# Altium project Pod3.PrjPcb
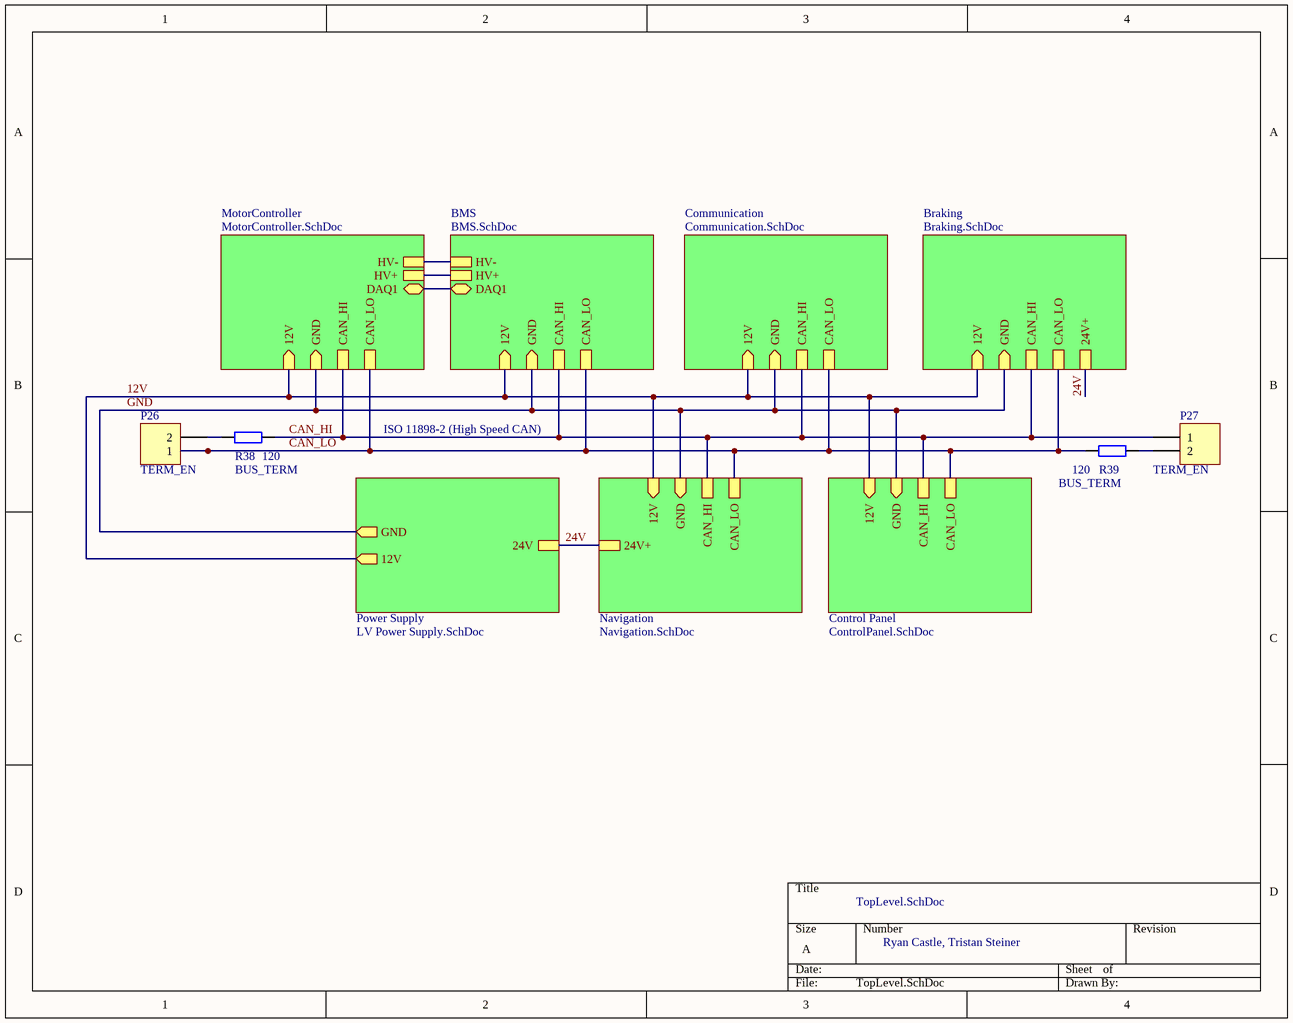
[diagram p0: TopLevel.SchDoc]
6 sheets, 148 parts. Net scope: hierarchical (ports join the sheet entries above them; power ports are global).
Board files: Navigation.PcbDoc, Braking.PcbDoc, Propulsion.PcbDoc, Communication.PcbDoc, ControlPanel.PcbDoc, Shutdown.PcbDoc
Sheets:
  TopLevel.SchDoc
    BMS = BMS.SchDoc
      BMS Main I/O Connector = BMSIOConnector.SchDoc
    Braking = Braking.SchDoc
    Navigation = Navigation.SchDoc
    Power Supply = LV Power Supply.SchDoc

## Sheet TopLevel.SchDoc
size A; SheetNumber: 1

### Parts
P26  TERM_EN  [HDR1X2]
P27  TERM_EN  [HDR1X2]
R38  BUS_TERM  value 120  [AXIAL-0.4]
R39  BUS_TERM  value 120  [AXIAL-0.4]

### Sub-sheets
BMS = BMS.SchDoc: CAN_HI, CAN_LO, 12V (in), GND (in), HV-, HV+, DAQ1 (bidir)
Braking = Braking.SchDoc: CAN_HI, CAN_LO, 12V (in), GND (in), 24V+
Communication = Communication.SchDoc (file not in this document): CAN_HI, CAN_LO, 12V (in), GND (in)
Control Panel = ControlPanel.SchDoc (file not in this document): CAN_HI, CAN_LO, 12V (in), GND (in)
MotorController = MotorController.SchDoc (file not in this document): CAN_HI, CAN_LO, 12V (in), GND (in), HV+, HV-, DAQ1 (bidir)
Navigation = Navigation.SchDoc: CAN_HI, CAN_LO, 12V (in), GND (in), 24V+
Power Supply = LV Power Supply.SchDoc: 12V (out), GND (out), 24V

### Nets
GND: sheet BMS/GND, sheet Communication/GND, sheet Braking/GND, sheet Navigation/GND, sheet Control Panel/GND, sheet MotorController/GND, sheet Power Supply/GND  [project net 12VBat-]
12V: sheet BMS/12V, sheet Communication/12V, sheet Braking/12V, sheet Navigation/12V, sheet Control Panel/12V, sheet MotorController/12V, sheet Power Supply/12V
24V: sheet Braking/24V+, sheet Navigation/24V+, sheet Power Supply/24V
CAN_HI: P27.1 R38.2 ; sheet BMS/CAN_HI, sheet Communication/CAN_HI, sheet Braking/CAN_HI, sheet Navigation/CAN_HI, sheet Control Panel/CAN_HI, sheet MotorController/CAN_HI
CAN_LO: P26.1 R39.1 ; sheet BMS/CAN_LO, sheet Communication/CAN_LO, sheet Braking/CAN_LO, sheet Navigation/CAN_LO, sheet Control Panel/CAN_LO, sheet MotorController/CAN_LO
HV+: sheet BMS/HV+, sheet MotorController/HV+
HV-: sheet BMS/HV-, sheet MotorController/HV-
NetP26_2: P26.2 R38.1
NetP27_2: P27.2 R39.2
(unnamed): sheet BMS/DAQ1, sheet MotorController/DAQ1

### Notes on the sheet
- ISO 11898-2 (High Speed CAN)
- TopLevel.SchDoc
- Ryan Castle, Tristan Steiner

### Library data of the parts
P26 P27 = Header 2: Header, 2-Pin; LatestRevisionDate: 17-Jul-2002; LatestRevisionNote: Re-released for DXP Platform.; Publisher: Altium Limited
R38 R39 = Res2: Resistor; Published: 8-Jun-2000; LatestRevisionDate: 17-Jul-2002; LatestRevisionNote: Re-released for DXP Platform.; PackageReference: AXIAL-0.4; Publisher: Altium Limited; PackageDescription: Axial Device, Thru-Hole; 2 Leads; 0.4 in Pin Spacing

## Sheet BMS.SchDoc: =Battery System
size B; SheetNumber: 2
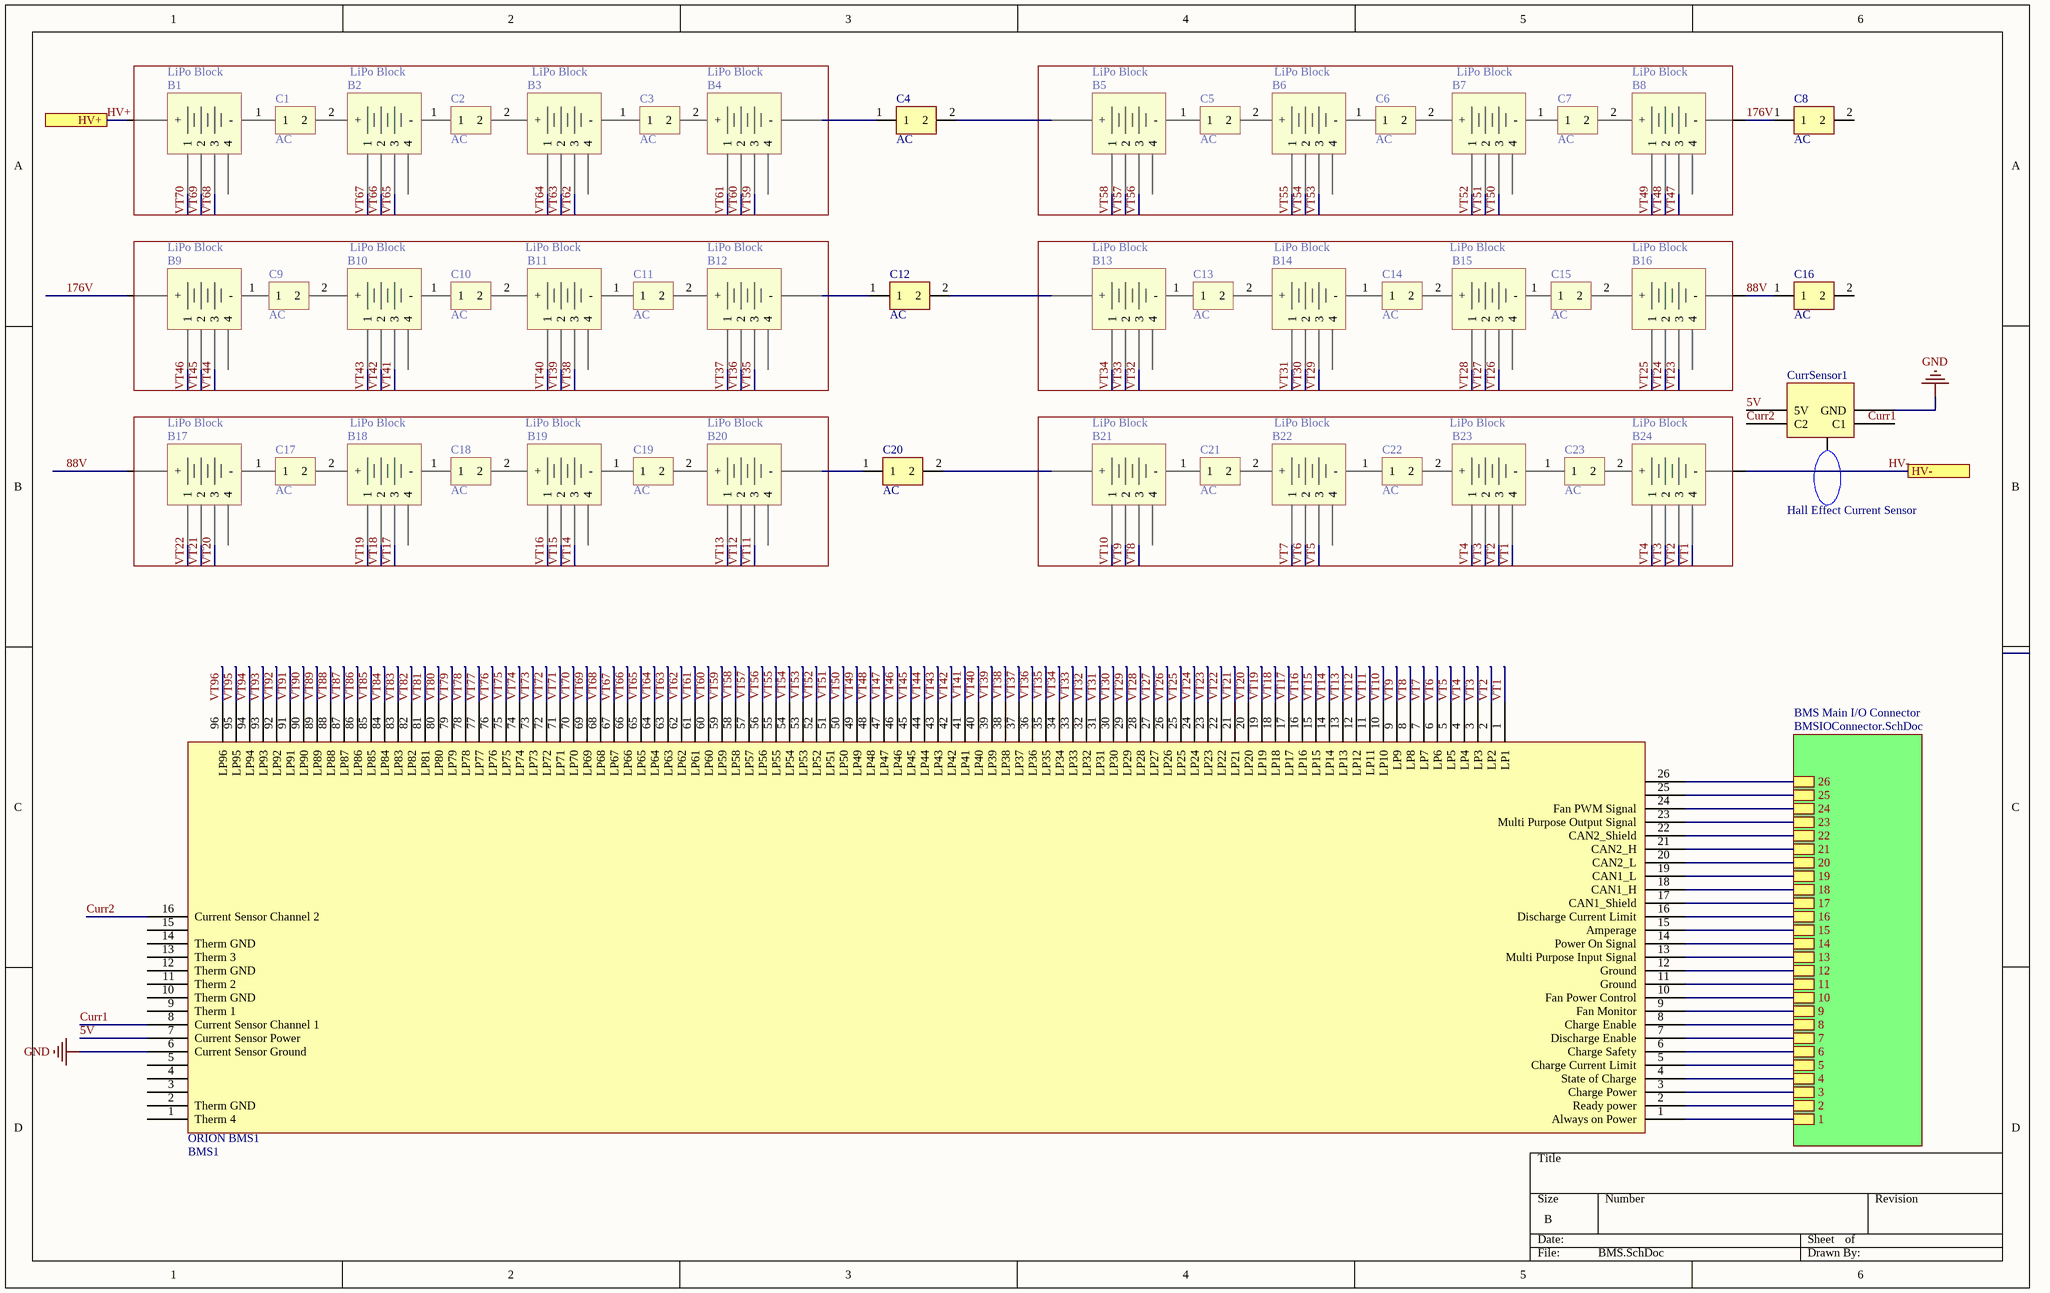
[diagram p1: BMS.SchDoc]

### Parts
B1  LiPo Block
B2  LiPo Block
B3  LiPo Block
B4  LiPo Block
B5  LiPo Block
B6  LiPo Block
B7  LiPo Block
B8  LiPo Block
B9  LiPo Block
B10  LiPo Block
B11  LiPo Block
B12  LiPo Block
B13  LiPo Block
B14  LiPo Block
B15  LiPo Block
B16  LiPo Block
B17  LiPo Block
B18  LiPo Block
B19  LiPo Block
B20  LiPo Block
B21  LiPo Block
B22  LiPo Block
B23  LiPo Block
B24  LiPo Block
C1  AC
C2  AC
C3  AC
C4  AC
C5  AC
C6  AC
C7  AC
C8  AC
C9  AC
C10  AC
C11  AC
C12  AC
C13  AC
C14  AC
C15  AC
C16  AC
C17  AC
C18  AC
C19  AC
C20  AC
C21  AC
C22  AC
C23  AC
CurrSensor1  Hall Effect Current Sensor
ORION_BMS1  BMS1

### Sub-sheets
BMS Main I/O Connector = BMSIOConnector.SchDoc: 26, 25, 24, 23, 22, 21, 20, 19, 18, 17, 16, 15, 14, 13, 12, 11, 10, 9, 8, 7, 6, 5, 4, 3, 2, 1

### Ports
HV+, HV-

### Nets
GND: CurrSensor1.2(GND) ORION_BMS1.6(Current_Sensor_Ground)  [project net 12VBat-]
5V: CurrSensor1.3(5V) ORION_BMS1.7(Current_Sensor_Power)
88V: B16.6(-) B17.5(+) C16.1
176V: B8.6(-) B9.5(+) C8.1
Curr1: ORION_BMS1.8(Current_Sensor_Channel_1)
Curr2: CurrSensor1.4(C2) ORION_BMS1.16(Current_Sensor_Channel_2)
HV+: B1.5(+) ; port HV+
HV-: B24.6(-) ; port HV-
VT1: B23.4 B24.4 ORION_BMS1.1(LP1)
VT2: B23.3 B24.3 ORION_BMS1.2(LP2)
VT3: B23.2 B24.2 ORION_BMS1.3(LP3)
VT4: B23.1 B24.1 ORION_BMS1.4(LP4)
VT5: B22.3 ORION_BMS1.5(LP5)
VT6: B22.2 ORION_BMS1.6(LP6)
VT7: B22.1 ORION_BMS1.7(LP7)
VT8: B21.3 ORION_BMS1.8(LP8)
VT9: B21.2 ORION_BMS1.9(LP9)
VT10: B21.1 ORION_BMS1.10(LP10)
VT11: B20.3 ORION_BMS1.11(LP11)
VT12: B20.2 ORION_BMS1.12(LP12)
VT13: B20.1 ORION_BMS1.13(LP13)
VT14: B19.3 ORION_BMS1.14(LP14)
VT15: B19.2 ORION_BMS1.15(LP15)
VT16: B19.1 ORION_BMS1.16(LP16)
VT17: B18.3 ORION_BMS1.17(LP17)
VT18: B18.2 ORION_BMS1.18(LP18)
VT19: B18.1 ORION_BMS1.19(LP19)
VT20: B17.3 ORION_BMS1.20(LP20)
VT21: B17.2 ORION_BMS1.21(LP21)
VT22: B17.1 ORION_BMS1.22(LP22)
VT23: B16.3 ORION_BMS1.23(LP23)
VT24: B16.2 ORION_BMS1.24(LP24)
VT25: B16.1 ORION_BMS1.25(LP25)
VT26: B15.3 ORION_BMS1.26(LP26)
VT27: B15.2 ORION_BMS1.27(LP27)
VT28: B15.1 ORION_BMS1.28(LP28)
VT29: B14.3 ORION_BMS1.29(LP29)
VT30: B14.2 ORION_BMS1.30(LP30)
VT31: B14.1 ORION_BMS1.31(LP31)
VT32: B13.3 ORION_BMS1.32(LP32)
VT33: B13.2 ORION_BMS1.33(LP33)
VT34: B13.1 ORION_BMS1.34(LP34)
VT35: B12.3 ORION_BMS1.35(LP35)
VT36: B12.2 ORION_BMS1.36(LP36)
VT37: B12.1 ORION_BMS1.37(LP37)
VT38: B11.3 ORION_BMS1.38(LP38)
VT39: B11.2 ORION_BMS1.39(LP39)
VT40: B11.1 ORION_BMS1.40(LP40)
VT41: B10.3 ORION_BMS1.41(LP41)
VT42: B10.2 ORION_BMS1.42(LP42)
VT43: B10.1 ORION_BMS1.43(LP43)
VT44: B9.3 ORION_BMS1.44(LP44)
VT45: B9.2 ORION_BMS1.45(LP45)
VT46: B9.1 ORION_BMS1.46(LP46)
VT47: B8.3 ORION_BMS1.47(LP47)
VT48: B8.2 ORION_BMS1.48(LP48)
VT49: B8.1 ORION_BMS1.49(LP49)
VT50: B7.3 ORION_BMS1.50(LP50)
VT51: B7.2 ORION_BMS1.51(LP51)
VT52: B7.1 ORION_BMS1.52(LP52)
VT53: B6.3 ORION_BMS1.53(LP53)
VT54: B6.2 ORION_BMS1.54(LP54)
VT55: B6.1 ORION_BMS1.55(LP55)
VT56: B5.3 ORION_BMS1.56(LP56)
VT57: B5.2 ORION_BMS1.57(LP57)
VT58: B5.1 ORION_BMS1.58(LP58)
VT59: B4.3 ORION_BMS1.59(LP59)
VT60: B4.2 ORION_BMS1.60(LP60)
VT61: B4.1 ORION_BMS1.61(LP61)
VT62: B3.3 ORION_BMS1.62(LP62)
VT63: B3.2 ORION_BMS1.63(LP63)
VT64: B3.1 ORION_BMS1.64(LP64)
VT65: B2.3 ORION_BMS1.65(LP65)
VT66: B2.2 ORION_BMS1.66(LP66)
VT67: B2.1 ORION_BMS1.67(LP67)
VT68: B1.3 ORION_BMS1.68(LP68)
VT69: B1.2 ORION_BMS1.69(LP69)
VT70: B1.1 ORION_BMS1.70(LP70)
VT71: ORION_BMS1.71(LP71)
VT72: ORION_BMS1.72(LP72)
VT73: ORION_BMS1.73(LP73)
VT74: ORION_BMS1.74(LP74)
VT75: ORION_BMS1.75(LP75)
VT76: ORION_BMS1.76(LP76)
VT77: ORION_BMS1.77(LP77)
VT78: ORION_BMS1.78(LP78)
VT79: ORION_BMS1.79(LP79)
VT80: ORION_BMS1.80(LP80)
VT81: ORION_BMS1.81(LP81)
VT82: ORION_BMS1.82(LP82)
VT83: ORION_BMS1.83(LP83)
VT84: ORION_BMS1.84(LP84)
VT85: ORION_BMS1.85(LP85)
VT86: ORION_BMS1.86(LP86)
VT87: ORION_BMS1.87(LP87)
VT88: ORION_BMS1.88(LP88)
VT89: ORION_BMS1.89(LP89)
VT90: ORION_BMS1.90(LP90)
VT91: ORION_BMS1.91(LP91)
VT92: ORION_BMS1.92(LP92)
VT93: ORION_BMS1.93(LP93)
VT94: ORION_BMS1.94(LP94)
VT95: ORION_BMS1.95(LP95)
VT96: ORION_BMS1.96(LP96)
NetB4_6: B4.6(-) C4.1
NetB5_5: B5.5(+) C4.2
NetB12_6: B12.6(-) C12.1
NetB13_5: B13.5(+) C12.2
NetB20_6: B20.6(-) C20.1
NetB21_5: B21.5(+) C20.2
NetORION_BMS1_1: ORION_BMS1.1(Therm_4) ; sheet BMS Main I/O Connector/1
NetORION_BMS1_2: ORION_BMS1.2(Therm_GND) ; sheet BMS Main I/O Connector/2
NetORION_BMS1_3: ORION_BMS1.3 ; sheet BMS Main I/O Connector/3
NetORION_BMS1_4: ORION_BMS1.4 ; sheet BMS Main I/O Connector/4
NetORION_BMS1_5: ORION_BMS1.5 ; sheet BMS Main I/O Connector/5
NetORION_BMS1_6: ORION_BMS1.6(Charge_Safety) ; sheet BMS Main I/O Connector/6
NetORION_BMS1_7: ORION_BMS1.7(Discharge_Enable) ; sheet BMS Main I/O Connector/7
NetORION_BMS1_8: ORION_BMS1.8(Charge_Enable) ; sheet BMS Main I/O Connector/8
NetORION_BMS1_9: ORION_BMS1.9(Therm_1) ; sheet BMS Main I/O Connector/9
NetORION_BMS1_10: ORION_BMS1.10(Therm_GND) ; sheet BMS Main I/O Connector/10
NetORION_BMS1_11: ORION_BMS1.11(Therm_2) ; sheet BMS Main I/O Connector/11
NetORION_BMS1_12: ORION_BMS1.12(Therm_GND) ; sheet BMS Main I/O Connector/12
NetORION_BMS1_13: ORION_BMS1.13(Therm_3) ; sheet BMS Main I/O Connector/13
NetORION_BMS1_14: ORION_BMS1.14(Therm_GND) ; sheet BMS Main I/O Connector/14
NetORION_BMS1_15: ORION_BMS1.15 ; sheet BMS Main I/O Connector/15
NetORION_BMS1_16: ORION_BMS1.16(Discharge_Current_Limit) ; sheet BMS Main I/O Connector/16
NetORION_BMS1_17: ORION_BMS1.17(CAN1_Shield) ; sheet BMS Main I/O Connector/17
NetORION_BMS1_18: ORION_BMS1.18(CAN1_H) ; sheet BMS Main I/O Connector/18
NetORION_BMS1_19: ORION_BMS1.19(CAN1_L) ; sheet BMS Main I/O Connector/19
NetORION_BMS1_20: ORION_BMS1.20(CAN2_L) ; sheet BMS Main I/O Connector/20
NetORION_BMS1_21: ORION_BMS1.21(CAN2_H) ; sheet BMS Main I/O Connector/21
NetORION_BMS1_22: ORION_BMS1.22(CAN2_Shield) ; sheet BMS Main I/O Connector/22
NetORION_BMS1_23: ORION_BMS1.23(Multi_Purpose_Output_Signal) ; sheet BMS Main I/O Connector/23
NetORION_BMS1_24: ORION_BMS1.24(Fan_PWM_Signal) ; sheet BMS Main I/O Connector/24
NetORION_BMS1_25: ORION_BMS1.25 ; sheet BMS Main I/O Connector/25
NetORION_BMS1_26: ORION_BMS1.26 ; sheet BMS Main I/O Connector/26

Not connected (* = marked no-connect by the designer): B1 4 6(-); B2 4 5(+) 6(-); B3 4 5(+) 6(-); B4 4 5(+); B5 4 6(-); B6 4 5(+) 6(-); B7 4 5(+) 6(-); B8 4 5(+); B9 4 6(-); B10 4 5(+) 6(-); B11 4 5(+) 6(-); B12 4 5(+); B13 4 6(-); B14 4 5(+) 6(-); B15 4 5(+) 6(-); B16 4 5(+); B17 4 6(-); B18 4 5(+) 6(-); B19 4 5(+) 6(-); B20 4 5(+); B21 4 6(-); B22 4 5(+) 6(-); B23 5(+) 6(-); B24 5(+); C1 1 2; C2 1 2; C3 1 2; C5 1 2; C6 1 2; C7 1 2; C8 2; C9 1 2; C10 1 2; C11 1 2; C13 1 2; C14 1 2; C15 1 2; C16 2; C17 1 2; C18 1 2; C19 1 2; C21 1 2; C22 1 2; C23 1 2; CurrSensor1 1(C1)

### Notes on the sheet
- Labels drawn without touching a wire or pin: Curr1

### Library data of the parts
B1-B24 = Li-Ion Cell
C1-C23 = Anderson Connector
ORION_BMS1 = ORION BMS

## Sheet BMSIOConnector.SchDoc
size A
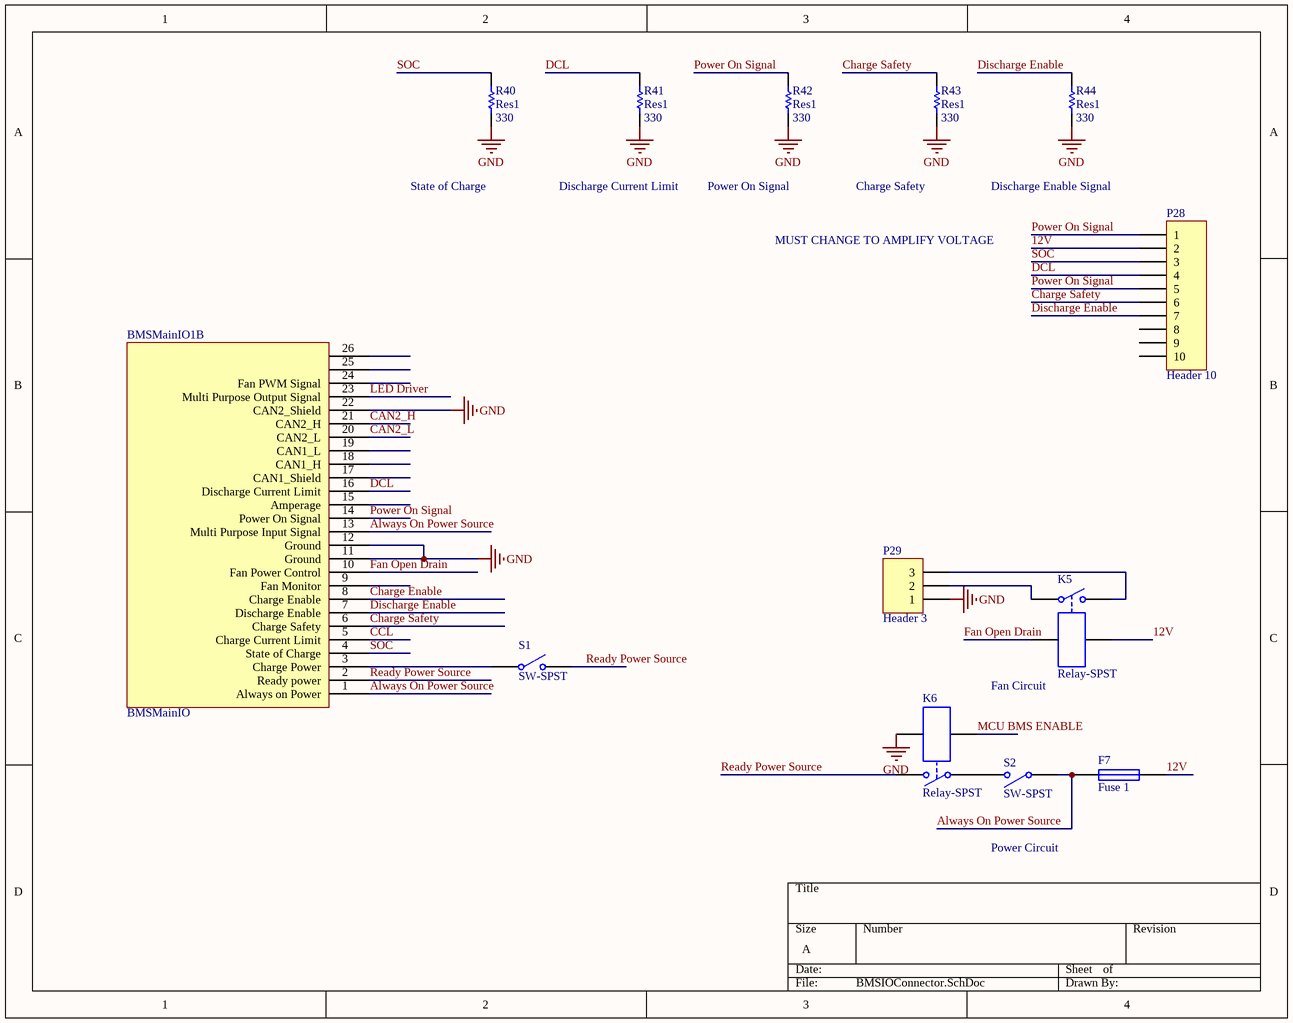
[diagram p2: BMSIOConnector.SchDoc]

### Parts
BMSMainIO1  BMSMainIO  (part B of 2)
F7  Fuse 1  [PIN-W2/E2.8]
K5  Relay-SPST  [MODULE4]
K6  Relay-SPST  [MODULE4]
P28  Header 10  [HDR1X10]
P29  Header 3  [HDR1X3]
R40  Res1  value 330  [AXIAL-0.3]
R41  Res1  value 330  [AXIAL-0.3]
R42  Res1  value 330  [AXIAL-0.3]
R43  Res1  value 330  [AXIAL-0.3]
R44  Res1  value 330  [AXIAL-0.3]
S1  SW-SPST  [SPST-2]
S2  SW-SPST  [SPST-2]

### Nets
GND: BMSMainIO1.11(Ground) BMSMainIO1.12(Ground) BMSMainIO1.22(CAN2_Shield) K6.4 P29.1 R40.2 R41.2 R42.2 R43.2 R44.2  [project net 12VBat-]
12V: F7.2 K5.4 P28.2
Always On Power Source: BMSMainIO1.1(Always_on_Power) BMSMainIO1.13(Multi_Purpose_Input_Signal) F7.1 S2.1(COMMON)
CAN2_H: BMSMainIO1.21(CAN2_H)
CAN2_L: BMSMainIO1.20(CAN2_L)
CCL: BMSMainIO1.5(Charge_Current_Limit)
Charge Enable: BMSMainIO1.8(Charge_Enable)
Charge Safety: BMSMainIO1.6(Charge_Safety) P28.6 R43.1
DCL: BMSMainIO1.16(Discharge_Current_Limit) P28.4 R41.1
Discharge Enable: BMSMainIO1.7(Discharge_Enable) P28.7 R44.1
Fan Open Drain: BMSMainIO1.10(Fan_Power_Control) K5.3
LED Driver: BMSMainIO1.23(Multi_Purpose_Output_Signal)
MCU BMS ENABLE: K6.3
Power On Signal: BMSMainIO1.14(Power_On_Signal) P28.1 P28.5 R42.1
Ready Power Source: BMSMainIO1.2(Ready_power) K6.2 S1.2(NO)
SOC: BMSMainIO1.4(State_of_Charge) P28.3 R40.1
NetBMSMainIO1_3: BMSMainIO1.3(Charge_Power) S1.1(COMMON)
NetK5_1: K5.1 P29.2
NetK5_2: K5.2 P29.3
NetK6_1: K6.1 S2.2(NO)

Not connected (* = marked no-connect by the designer): BMSMainIO1 9(Fan_Monitor) 15(Amperage) 17(CAN1_Shield) 18(CAN1_H) 19(CAN1_L) 24(Fan_PWM_Signal) 25 26; P28 8 9 10

### Notes on the sheet
- State of Charge
- Discharge Current Limit
- Power On Signal
- Charge Safety
- Discharge Enable Signal
- MUST CHANGE TO AMPLIFY VOLTAGE
- Fan Circuit
- Power Circuit

### Library data of the parts
F7 = Fuse 1: Fuse; Published: 8-Jun-2000; LatestRevisionDate: 17-Jul-2002; LatestRevisionNote: Re-released for DXP Platform.; PackageReference: PIN-W2/E2.8; Publisher: Altium Limited; PackageDescription: Thru-Hole; 2 Leads
K5 K6 = Relay-SPST: Single-Pole Single-Throw Relay; Published: 24-Mar-1999; LatestRevisionDate: 17-Jul-2002; LatestRevisionNote: Re-released for DXP Platform.; PackageReference: MODULE4; Publisher: Altium Limited
P28 = Header 10: Header, 10-Pin; LatestRevisionDate: 17-Jul-2002; LatestRevisionNote: Re-released for DXP Platform.; Publisher: Altium Limited
P29 = Header 3: Header, 3-Pin; LatestRevisionDate: 17-Jul-2002; LatestRevisionNote: Re-released for DXP Platform.; Publisher: Altium Limited
R40-R44 = Res1: Resistor; Published: 8-Jun-2000; LatestRevisionDate: 17-Jul-2002; LatestRevisionNote: Re-released for DXP Platform.; PackageReference: AXIAL-0.3; Publisher: Altium Limited; PackageDescription: Axial Device, Thru-Hole; 2 Leads; 0.3 in Pin Spacing
S1 S2 = SW-SPST: Single-Pole, Single-Throw Switch; Published: 24-Mar-1999; LatestRevisionDate: 17-Jul-2002; LatestRevisionNote: Re-released for DXP Platform.; PackageReference: SPST-2; Publisher: Altium Limited; PackageDescription: Switch; 2 Leads

## Sheet Braking.SchDoc
size 330 x 381 mm
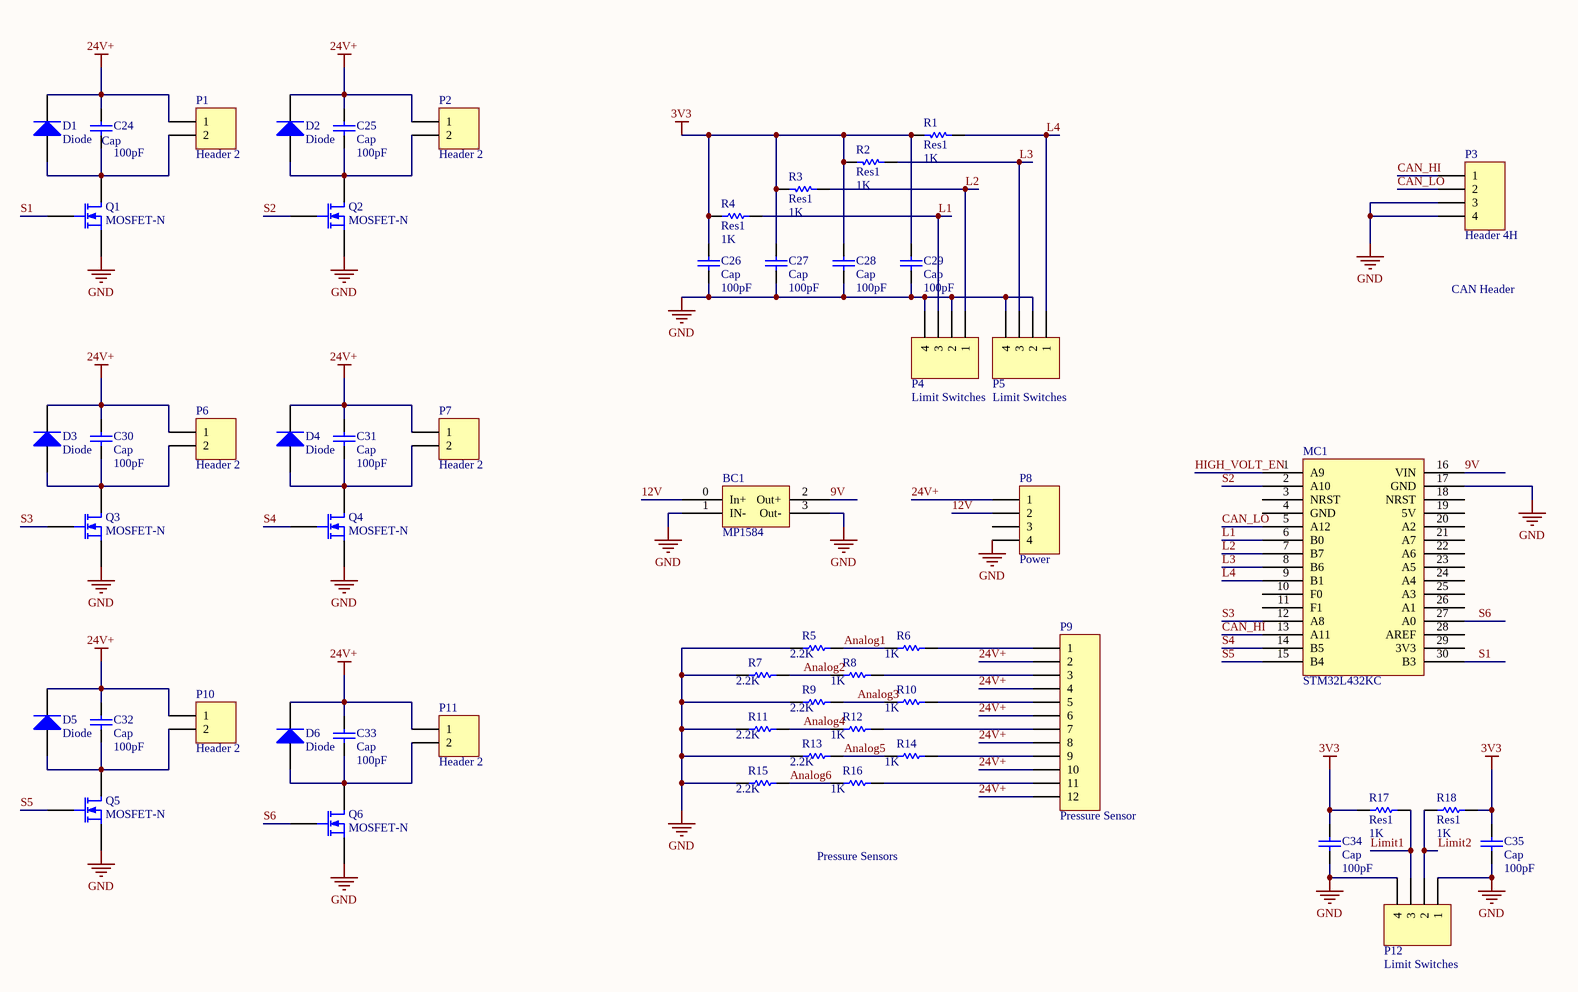
[diagram p3: Braking.SchDoc]

### Parts
BC1  MP1584
C24  Cap  value 100pF  [RAD-0.3]
C25  Cap  value 100pF  [RAD-0.3]
C26  Cap  value 100pF  [RAD-0.3]
C27  Cap  value 100pF  [RAD-0.3]
C28  Cap  value 100pF  [RAD-0.3]
C29  Cap  value 100pF  [RAD-0.3]
C30  Cap  value 100pF  [RAD-0.3]
C31  Cap  value 100pF  [RAD-0.3]
C32  Cap  value 100pF  [RAD-0.3]
C33  Cap  value 100pF  [RAD-0.3]
C34  Cap  value 100pF  [RAD-0.3]
C35  Cap  value 100pF  [RAD-0.3]
D1  Diode  [SMC]
D2  Diode  [SMC]
D3  Diode  [SMC]
D4  Diode  [SMC]
D5  Diode  [SMC]
D6  Diode  [SMC]
MC1  STM32L432KC
P1  Header 2  [HDR1X2]
P2  Header 2  [HDR1X2]
P3  Header 4H  [HDR1X4H]
P4  Limit Switches  [HDR1X4]
P5  Limit Switches  [HDR1X4]
P6  Header 2  [HDR1X2]
P7  Header 2  [HDR1X2]
P8  Power  [HDR1X4]
P9  Pressure Sensor  [HDR1X12]
P10  Header 2  [HDR1X2]
P11  Header 2  [HDR1X2]
P12  Limit Switches  [HDR1X4]
Q1  MOSFET-N  [E3]
Q2  MOSFET-N  [E3]
Q3  MOSFET-N  [E3]
Q4  MOSFET-N  [E3]
Q5  MOSFET-N  [E3]
Q6  MOSFET-N  [E3]
R1  Res1  value 1K  [AXIAL-0.3]
R2  Res1  value 1K  [AXIAL-0.3]
R3  Res1  value 1K  [AXIAL-0.3]
R4  Res1  value 1K  [AXIAL-0.3]
R5  value 2.2K  [AXIAL-0.3]  (hidden comment: Res1)
R6  value 1K  [AXIAL-0.3]  (hidden comment: Res1)
R7  value 2.2K  [AXIAL-0.3]  (hidden comment: Res1)
R8  value 1K  [AXIAL-0.3]  (hidden comment: Res1)
R9  value 2.2K  [AXIAL-0.3]  (hidden comment: Res1)
R10  value 1K  [AXIAL-0.3]  (hidden comment: Res1)
R11  value 2.2K  [AXIAL-0.3]  (hidden comment: Res1)
R12  value 1K  [AXIAL-0.3]  (hidden comment: Res1)
R13  value 2.2K  [AXIAL-0.3]  (hidden comment: Res1)
R14  value 1K  [AXIAL-0.3]  (hidden comment: Res1)
R15  value 2.2K  [AXIAL-0.3]  (hidden comment: Res1)
R16  value 1K  [AXIAL-0.3]  (hidden comment: Res1)
R17  Res1  value 1K  [AXIAL-0.3]
R18  Res1  value 1K  [AXIAL-0.3]

### Nets
3V3: C26.2 C27.2 C28.2 C29.2 C34.2 C35.2 R1.2 R2.2 R3.2 R4.1 R17.1 R18.2
24V+: C24.1 C25.1 C30.1 C31.1 C32.1 C33.1 D1.2(K) D2.2(K) D3.2(K) D4.2(K) D5.2(K) D6.2(K) P1.1 P2.1 P6.1 P7.1 P8.1 P9.2 P9.4 P9.6 P9.8 P9.10 P9.12 P10.1 P11.1
GND: BC1.1(IN-) BC1.3(Out-) C26.1 C27.1 C28.1 C29.1 C34.1 C35.1 MC1.17(GND) P3.3 P3.4 P4.2 P4.4 P5.2 P5.4 P8.4 P12.1 P12.4 Q1.3(S) Q2.3(S) Q3.3(S) Q4.3(S) Q5.3(S) Q6.3(S) R5.1 R7.1 R9.1 R11.1 R13.1 R15.1  [project net 12VBat-]
9V: BC1.2(Out+) MC1.16(VIN)
12V: BC1.0(In+) P8.2
Analog1: R5.2 R6.1
Analog2: R7.2 R8.1
Analog3: R9.2 R10.1
Analog4: R11.2 R12.1
Analog5: R13.2 R14.1
Analog6: R15.2 R16.1
CAN_HI: MC1.13(A11) P3.1
CAN_LO: MC1.5(A12) P3.2
HIGH_VOLT_EN: MC1.1(A9)
L1: MC1.6(B0) P4.3 R4.2
L2: MC1.7(B7) P4.1 R3.1
L3: MC1.8(B6) P5.3 R2.1
L4: MC1.9(B1) P5.1 R1.1
Limit1: P12.3 R17.2
Limit2: P12.2 R18.1
S1: MC1.30(B3) Q1.2(G)
S2: MC1.2(A10) Q2.2(G)
S3: MC1.12(A8) Q3.2(G)
S4: MC1.14(B5) Q4.2(G)
S5: MC1.15(B4) Q5.2(G)
S6: MC1.27(A0) Q6.2(G)
NetC24_2: C24.2 D1.1(A) P1.2 Q1.1(D)
NetC25_2: C25.2 D2.1(A) P2.2 Q2.1(D)
NetC30_2: C30.2 D3.1(A) P6.2 Q3.1(D)
NetC31_2: C31.2 D4.1(A) P7.2 Q4.1(D)
NetC32_2: C32.2 D5.1(A) P10.2 Q5.1(D)
NetC33_2: C33.2 D6.1(A) P11.2 Q6.1(D)
NetP9_1: P9.1 R6.2
NetP9_3: P9.3 R8.2
NetP9_5: P9.5 R10.2
NetP9_7: P9.7 R12.2
NetP9_9: P9.9 R14.2
NetP9_11: P9.11 R16.2

Not connected (* = marked no-connect by the designer): MC1 3(NRST) 4(GND) 10(F0) 11(F1) 18(NRST) 19(5V) 20(A2) 21(A7) 22(A6) 23(A5) 24(A4) 25(A3) 26(A1) 28(AREF) 29(3V3); P8 3

### Notes on the sheet
- CAN Header
- Pressure Sensors

### Library data of the parts
C24-C35 = Cap: Capacitor; Published: 8-Jun-2000; LatestRevisionDate: 17-Jul-2002; LatestRevisionNote: Re-released for DXP Platform.; PackageReference: RAD-0.3; Publisher: Altium Limited; PackageDescription: Radial Cap, Thru-Hole; 2 Leads; 0.3 in Pin Spacing
D1-D6 = Diode: Default Diode; Published: 8-Jun-2000; LatestRevisionDate: 17-Jul-2002; LatestRevisionNote: Re-released for DXP Platform.; PackageVersion: Sep-1996; PackageReference: SMC; Publisher: Altium Limited; PackageDescription: DO-214-AB/SMC; 2 C-Bend Leads; Body 7.9 x 5.9 mm, inc. leads (LxW); Code_JEDEC: DO-214-AB
MC1 = STMF303K8
P1 P2 P6 P7 P10 P11 = Header 2: Header, 2-Pin; LatestRevisionDate: 17-Jul-2002; LatestRevisionNote: Re-released for DXP Platform.; Publisher: Altium Limited
P3 = Header 4H: Header, 4-Pin, Right Angle; LatestRevisionDate: 17-Jul-2002; LatestRevisionNote: Re-released for DXP Platform.; Publisher: Altium Limited
P4 P5 P8 P12 = Header 4: Header, 4-Pin; LatestRevisionDate: 17-Jul-2002; LatestRevisionNote: Re-released for DXP Platform.; Publisher: Altium Limited
P9 = Header 12: Header, 12-Pin; LatestRevisionDate: 17-Jul-2002; LatestRevisionNote: Re-released for DXP Platform.; Publisher: Altium Limited
Q1-Q6 = MOSFET-N: N-Channel MOSFET; Published: 8-Jun-2000; LatestRevisionDate: 17-Jul-2002; LatestRevisionNote: Re-released for DXP Platform.; PackageVersion: 1995/1996; PackageReference: E3; Publisher: Altium Limited; PackageDescription: TO, Flat Index; 3 In-Line, Axial Leads; Body Dia. 4.6mm; Lead Dia. 0.5 mm (max)
R1-R18 = Res1: Resistor; Published: 8-Jun-2000; LatestRevisionDate: 17-Jul-2002; LatestRevisionNote: Re-released for DXP Platform.; PackageReference: AXIAL-0.3; Publisher: Altium Limited; PackageDescription: Axial Device, Thru-Hole; 2 Leads; 0.3 in Pin Spacing

## Sheet Navigation.SchDoc
size A
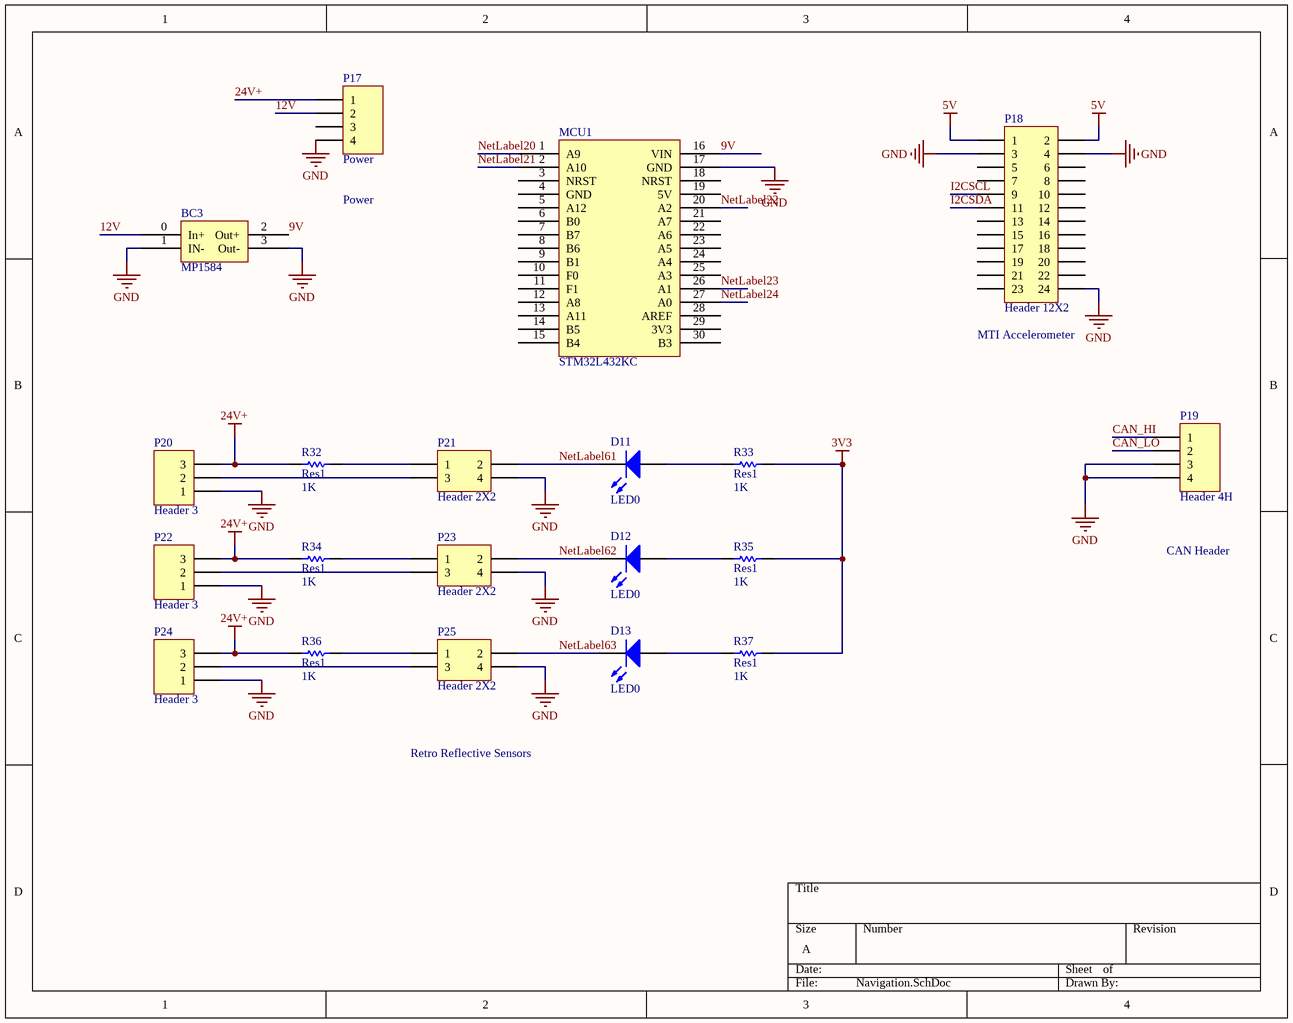
[diagram p4: Navigation.SchDoc]

### Parts
BC3  MP1584
D11  LED0  [LED-0]
D12  LED0  [LED-0]
D13  LED0  [LED-0]
MCU1  STM32L432KC
P17  Power  [HDR1X4]
P18  Header 12X2  [HDR2X12]
P19  Header 4H  [HDR1X4H]
P20  Header 3  [HDR1X3]
P21  Header 2X2  [HDR2X2]
P22  Header 3  [HDR1X3]
P23  Header 2X2  [HDR2X2]
P24  Header 3  [HDR1X3]
P25  Header 2X2  [HDR2X2]
R32  Res1  value 1K  [AXIAL-0.3]
R33  Res1  value 1K  [AXIAL-0.3]
R34  Res1  value 1K  [AXIAL-0.3]
R35  Res1  value 1K  [AXIAL-0.3]
R36  Res1  value 1K  [AXIAL-0.3]
R37  Res1  value 1K  [AXIAL-0.3]

### Nets
3V3: R33.2 R35.2 R37.2
5V: P18.1 P18.2
24V+: P17.1 P20.3 P22.3 P24.3 R32.1 R34.1 R36.1
GND: BC3.1(IN-) BC3.3(Out-) MCU1.17(GND) P17.4 P18.3 P18.4 P18.24 P19.3 P19.4 P20.1 P21.4 P22.1 P23.4 P24.1 P25.4  [project net 12VBat-]
9V: BC3.2(Out+) MCU1.16(VIN)
12V: BC3.0(In+) P17.2
CAN_HI: P19.1
CAN_LO: P19.2
I2CSCL: P18.9
I2CSDA: P18.11
NetLabel20: MCU1.1(A9)
NetLabel21: MCU1.2(A10)
NetLabel22: MCU1.20(A2)
NetLabel23: MCU1.26(A1)
NetLabel24: MCU1.27(A0)
NetLabel61: D11.2(K) P21.2
NetLabel62: D12.2(K) P23.2
NetLabel63: D13.2(K) P25.2
NetD11_1: D11.1(A) R33.1
NetD12_1: D12.1(A) R35.1
NetD13_1: D13.1(A) R37.1
NetP20_2: P20.2 P21.3
NetP21_1: P21.1 R32.2
NetP22_2: P22.2 P23.3
NetP23_1: P23.1 R34.2
NetP24_2: P24.2 P25.3
NetP25_1: P25.1 R36.2

Not connected (* = marked no-connect by the designer): MCU1 3(NRST) 4(GND) 5(A12) 6(B0) 7(B7) 8(B6) 9(B1) 10(F0) 11(F1) 12(A8) 13(A11) 14(B5) 15(B4) 18(NRST) 19(5V) 21(A7) 22(A6) 23(A5) 24(A4) 25(A3) 28(AREF) 29(3V3) 30(B3); P17 3; P18 5 6 7 8 10 12 13 14 15 16 17 18 19 20 21 22 23

### Notes on the sheet
- Power
- (near P18) MTI Accelerometer
- CAN Header
- Retro Reflective Sensors

### Library data of the parts
D11-D13 = LED0: Typical INFRARED GaAs LED; Published: 8-Jun-2000; LatestRevisionDate: 08-Jul-2005; LatestRevisionNote: Mech Layer 1 removed.; PackageReference: LED-0; Publisher: Altium Limited; PackageDescription: LED; 2 Leads
MCU1 = STMF303K8
P17 = Header 4: Header, 4-Pin; LatestRevisionDate: 17-Jul-2002; LatestRevisionNote: Re-released for DXP Platform.; Publisher: Altium Limited
P18 = Header 12X2: Header, 12-Pin, Dual row; LatestRevisionDate: 17-Jul-2002; LatestRevisionNote: Re-released for DXP Platform.; Publisher: Altium Limited
P19 = Header 4H: Header, 4-Pin, Right Angle; LatestRevisionDate: 17-Jul-2002; LatestRevisionNote: Re-released for DXP Platform.; Publisher: Altium Limited
P20 P22 P24 = Header 3: Header, 3-Pin; LatestRevisionDate: 17-Jul-2002; LatestRevisionNote: Re-released for DXP Platform.; Publisher: Altium Limited
P21 P23 P25 = Header 2X2: Header, 2-Pin, Dual row; LatestRevisionDate: 17-Jul-2002; LatestRevisionNote: Re-released for DXP Platform.; Publisher: Altium Limited
R32-R37 = Res1: Resistor; Published: 8-Jun-2000; LatestRevisionDate: 17-Jul-2002; LatestRevisionNote: Re-released for DXP Platform.; PackageReference: AXIAL-0.3; Publisher: Altium Limited; PackageDescription: Axial Device, Thru-Hole; 2 Leads; 0.3 in Pin Spacing

## Sheet LV Power Supply.SchDoc
size OrCAD A
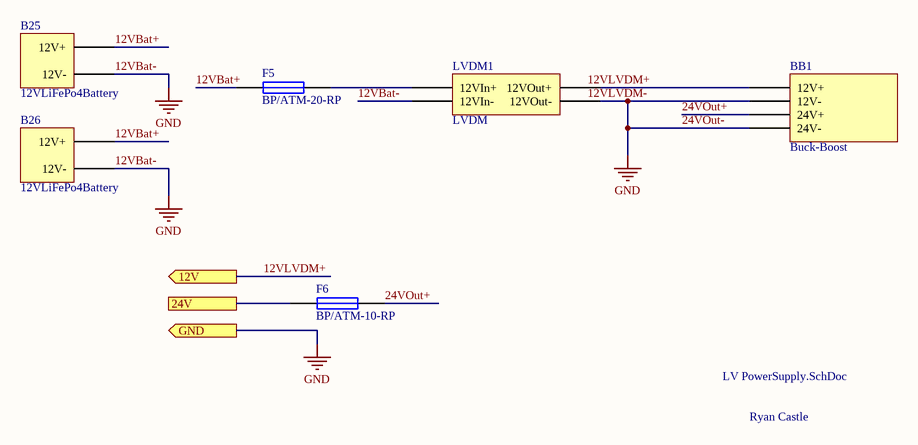
[diagram p5: LV Power Supply.SchDoc]

### Parts
B25  12VLiFePo4Battery
B26  12VLiFePo4Battery
BB1  Buck-Boost
F5  BP/ATM-20-RP  [PIN-W2/E2.8]
F6  BP/ATM-10-RP  [PIN-W2/E2.8]
LVDM1  LVDM

### Ports
12V (out), 24V, GND (out)

### Nets
12VBat-: B25.2(12V-) B26.2(12V-) BB1.13(24V-) BB1.15(12V-) LVDM1.10(12VIn-) LVDM1.12(12VOut-) ; port GND  [also labelled 24VOut-, GND]
12VBat+: B25.1(12V+) B26.1(12V+) F5.1
24V: F6.1 ; port 24V
24VOut+: BB1.14(24V+) F6.2
NetBB1_16: BB1.16(12V+) LVDM1.11(12VOut+)
NetF5_2: F5.2 LVDM1.9(12VIn+)

### Notes on the sheet
- LV PowerSupply.SchDoc
- Ryan Castle
- Labels drawn without touching a wire or pin: 12VLVDM+, 12VLVDM-

### Library data of the parts
BB1 = 12-24 BuckBoost
F5 F6 = Fuse 1: Fuse; Published: 8-Jun-2000; LatestRevisionDate: 17-Jul-2002; LatestRevisionNote: Re-released for DXP Platform.; PackageReference: PIN-W2/E2.8; Publisher: Altium Limited; PackageDescription: Thru-Hole; 2 Leads

## Nets that join several sheets
3V3: Braking (12 pins), Navigation (R33.2 R35.2 R37.2)
12VBat-: BMS (CurrSensor1.2 ORION_BMS1.6), BMSIOConnector (10 pins), Braking (30 pins), Navigation (15 pins), LV Power Supply (6 pins)
24V+: Braking (25 pins), Navigation (7 pins)